# Altium project Mosfet_Driver_Circuit.PrjPcb
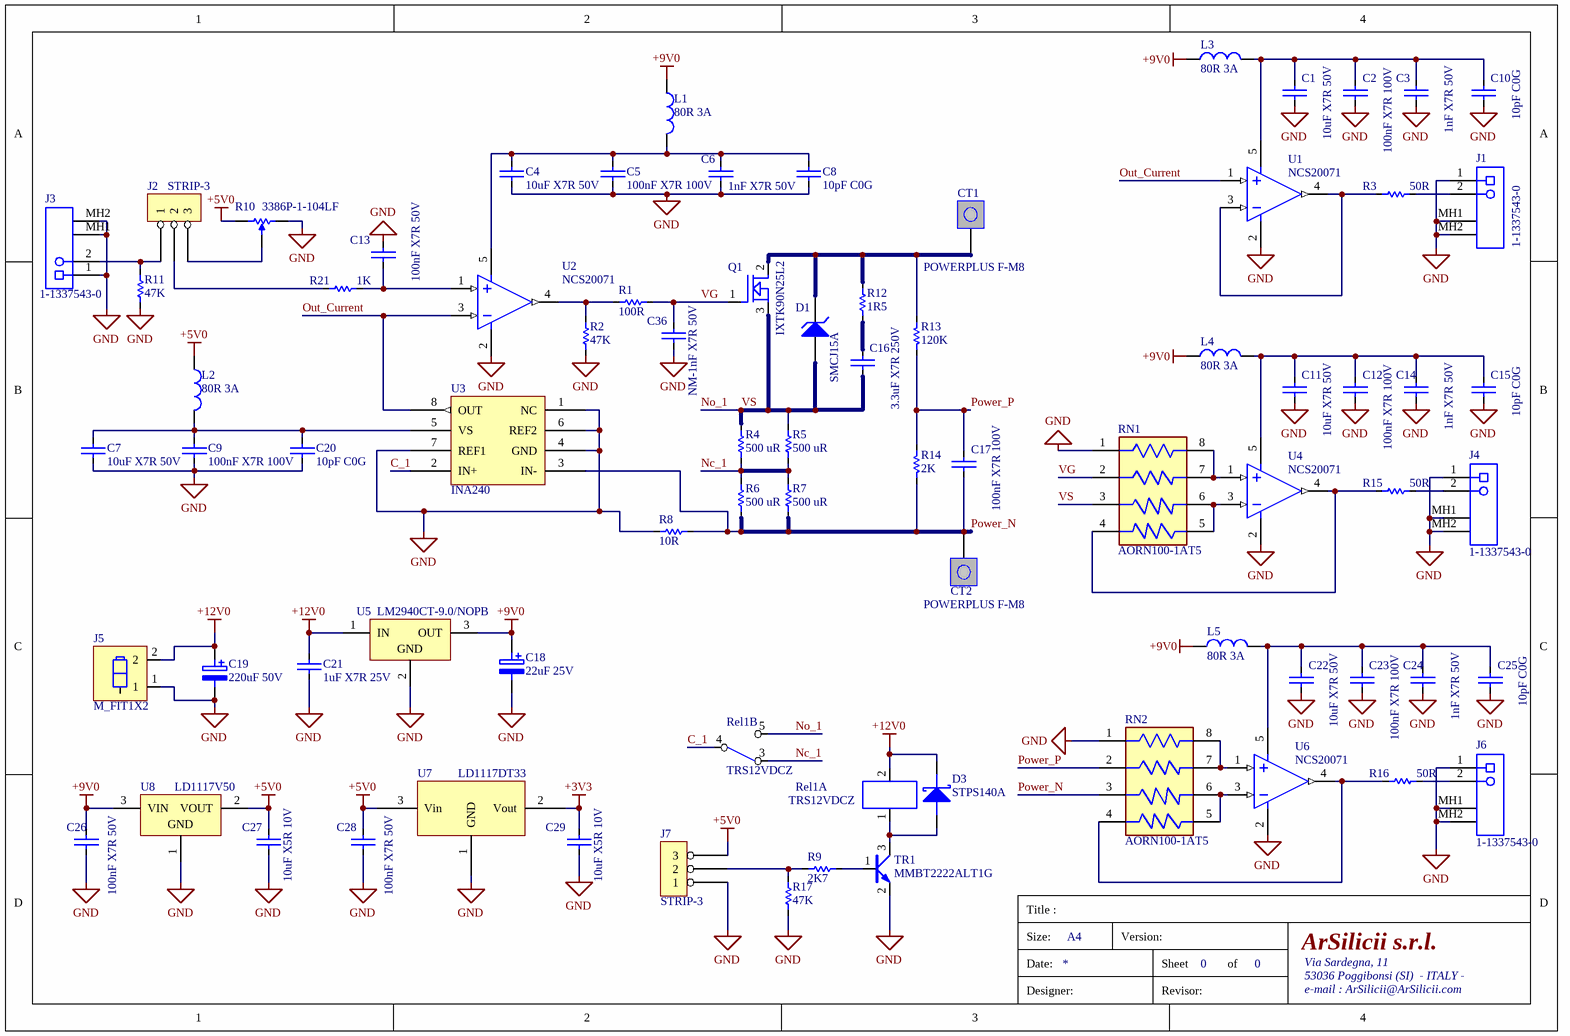
[diagram p0: Mosfet_Driver_Circuit.SchDoc]
1 sheet, 77 parts. Net scope: global (net labels, ports and power ports of the same name join across sheets).
Board file: Mosfet_Driver_Circuit.PcbDoc

## Sheet Mosfet_Driver_Circuit.SchDoc
size A4; Organization: ArSilicii s.r.l.; Address1: Via Sardegna, 11; Address2: 53036 Poggibonsi (SI)  - ITALY -; Address3: e-mail : ArSilicii@ArSilicii.com; SheetNumber: 0; SheetTotal: 0

### Parts
C1  10uF X7R 50V  [1206]
C2  100nF X7R 100V  [0805]
C3  1nF X7R 50V  [0805]
C4  10uF X7R 50V  [1206]
C5  100nF X7R 100V  [0805]
C6  1nF X7R 50V  [0805]
C7  10uF X7R 50V  [1206]
C8  10pF C0G  [0805]
C9  100nF X7R 100V  [0805]
C10  10pF C0G  [0805]
C11  10uF X7R 50V  [1206]
C12  100nF X7R 100V  [0805]
C13  100nF X7R 50V  [0805]
C14  1nF X7R 50V  [0805]
C15  10pF C0G  [0805]
C16  3.3uF X7R 250V  [2220]
C17  100nF X7R 100V  [0805]
C18  22uF 25V  [TANT_D]
C19  220uF 50V  [C_G55]
C20  10pF C0G  [0805]
C21  1uF X7R 25V  [0805]
C22  10uF X7R 50V  [1206]
C23  100nF X7R 100V  [0805]
C24  1nF X7R 50V  [0805]
C25  10pF C0G  [0805]
C26  100nF X7R 50V  [0805]
C27  10uF X5R 10V  [0805]
C28  100nF X7R 50V  [0805]
C29  10uF X5R 10V  [0805]
C36  NM-1nF X7R 50V  [0805]
CT1  POWERPLUS F-M8  [PowerPlus M8]
CT2  POWERPLUS F-M8  [PowerPlus M8]
D1  SMCJ15A  [LFUS-DO-214AB-2_V]
D3  STPS140A  [SMA]
J1  1-1337543-0  [TECO-1-1337543-0_V]
J2  STRIP-3  [SIP-3]
J3  1-1337543-0  [TECO-1-1337543-0_V]
J4  1-1337543-0  [TECO-1-1337543-0_V]
J5  M_FIT1X2  [M_FIT_JR1X2V]
J6  1-1337543-0  [TECO-1-1337543-0_V]
J7  STRIP-3  [SIP-3]
L1  80R 3A  [1206]
L2  80R 3A  [1206]
L3  80R 3A  [1206]
L4  80R 3A  [1206]
L5  80R 3A  [1206]
Q1  IXTK90N25L2  [TO-247]
R1  100R  [0805]
R2  47K  [0805]
R3  50R  [0805]
R4  500 uR  [2512]
R5  500 uR  [2512]
R6  500 uR  [2512]
R7  500 uR  [2512]
R8  10R  [1206]
R9  2K7  [0805]
R10  3386P-1-104LF  [BOUR-3386P]
R11  47K  [0805]
R12  1R5  [2512]
R13  120K  [2512]
R14  2K  [2512]
R15  50R  [0805]
R16  50R  [0805]
R17  47K  [0805]
R21  1K  [0805]
Rel1  TRS12VDCZ  [RELE_TRS]  (parts A,B of 2)
RN1  AORN100-1AT5  [FP-AORN100-1AT5-IPC_C]
RN2  AORN100-1AT5  [FP-AORN100-1AT5-IPC_C]
TR1  MMBT2222ALT1G  [SOT-23]
U1  NCS20071  [SOT-553-5]
U2  NCS20071  [SOT-553-5]
U3  INA240  [TSSOP-8]
U4  NCS20071  [SOT-553-5]
U5  LM2940CT-9.0/NOPB  [NDE0003A]
U6  NCS20071  [SOT-553-5]
U7  LD1117DT33  [TO-252-7805]
U8  LD1117V50  [TO220]

### Nets
+3V3: C29.1 U7.2(Vout)
+5V0: C27.1 C28.1 J7.3 L2.1 R10.1 U7.3(Vin) U8.2(VOUT)
+9V0: C18.1 C26.1 L1.1 L3.1 L4.1 L5.1 U5.3(OUT) U8.3(VIN)
+12V0: C19.1 C21.1 D3.K J5.2 Rel1.2 U5.1(IN)
GND: C1.2 C2.2 C3.2 C4.2 C5.2 C6.2 C7.2 C8.2 C9.2 C10.2 C11.2 C12.2 C13.1 C14.2 C15.2 C18.2 C19.2 C20.2 C21.2 C22.2 C23.2 C24.2 C25.2 C26.2 C27.2 C28.2 C29.2 C36.2 J1.1 J1.MH1 J1.MH2 J3.1 J3.MH1 J3.MH2 J4.1 J4.MH1 J4.MH2 J5.1 J6.1 J6.MH1 J6.MH2 J7.1 R2.2 R8.2 R10.3 R11.1 R17.2 RN1.1 RN2.1 TR1.2(E) U1.2 U2.2 U3.1(NC) U3.4(GND) U3.6(REF2) U3.7(REF1) U4.2 U5.2(GND) U6.2 U7.1(GND) U8.1(GND)
C_1: Rel1.4 U3.2(IN+)
Nc_1: R4.2 R5.2 R6.1 R7.1 Rel1.3
No_1: C16.2 D1.1(A) Q1.3(SOURCE) R4.1 R5.1 Rel1.5 RN1.3  [also labelled VS]
Out_Current: U1.1 U2.3 U3.8(OUT)
Power_N: C17.2 CT2.1 R6.2 R7.2 R8.1 R14.2 RN2.3 U3.3(IN-)
Power_P: C17.1 R13.2 R14.1 RN2.2
VG: C36.1 Q1.1(GATE) R1.2 RN1.2
NetC1_1: C1.1 C2.1 C3.1 C10.1 L3.2 U1.5
NetC4_1: C4.1 C5.1 C6.1 C8.1 L1.2 U2.5
NetC7_1: C7.1 C9.1 C20.1 L2.2 U3.5(VS)
NetC11_1: C11.1 C12.1 C14.1 C15.1 L4.2 U4.5
NetC13_2: C13.2 R21.2 U2.1
NetC16_1: C16.1 R12.2
NetC22_1: C22.1 C23.1 C24.1 C25.1 L5.2 U6.5
NetCT1_1: CT1.1 D1.2(K) Q1.2(DRAIN) R12.1 R13.1
NetD3_A: D3.A Rel1.1 TR1.3(C)
NetJ1_2: J1.2 R3.1
NetJ2_1: J2.1 J3.2 R11.2
NetJ2_2: J2.2 R21.1
NetJ2_3: J2.3 R10.2
NetJ4_2: J4.2 R15.1
NetJ6_2: J6.2 R16.1
NetJ7_2: J7.2 R9.2 R17.1
NetR1_1: R1.1 R2.1 U2.4
NetR3_2: R3.2 U1.3 U1.4
NetR9_1: R9.1 TR1.1(B)
NetR15_2: R15.2 RN1.4 U4.4
NetR16_2: R16.2 RN2.4 U6.4
NetRN1_5: RN1.5 RN1.6 U4.3
NetRN1_7: RN1.7 RN1.8 U4.1
NetRN2_5: RN2.5 RN2.6 U6.3
NetRN2_7: RN2.7 RN2.8 U6.1

### Notes on the sheet
- Title :
- Size:
- Date:
- A4
- Version:
- Sheet
- of
- Designer:
- Revisor:

### Library data of the parts
C1 C4 C7 C11 C22 = CAP_10uF X7R 50V_1206: Capacità; ArSilicii Part Number: CPC0232011; Manufacturer Part Number: CL31B106KBHNNNE; SMD/TH: SMD; 1 Supplier: ARROW ELECTRONICS ITALIA S.R.L.; 1 Supplier Part Number: CL31B106KBHNNNE; 1 Supplier Unit Price: *; 2 Supplier: *; 2 Supplier Part Number: *; 2 Supplier Unit Price: *; 3 Supplier: *; 3 Supplier Part Number: *; 3 Supplier Unit Price: *; Manufacturer: *; ComponentLink1URL: *; ComponentLink2URL: *; ComponentLink1Description: Datasheet for 10uF X7R 25V; ComponentLink2Description: *; HelpURL: *
C2 C5 C9 C12 C17 C23 = CAP_100nF X7R 100V_0805: Capacità; ArSilicii Part Number: CPC0213101; Manufacturer: SAMSUNG; Manufacturer Part Number: CL21B104KCFSFNG; SMD/TH: SMD; 1 Supplier: ARROW ELECTRONICS ITALIA S.R.L.; 1 Supplier Part Number: CL21B104KCFSFNG; 1 Supplier Unit Price: *; 2 Supplier: FARNELL ITALIA S.R.L.; 2 Supplier Part Number: 1907331; 2 Supplier Unit Price: *; 3 Supplier: *; 3 Supplier Part Number: *; 3 Supplier Unit Price: *; ComponentLink1URL: *; ComponentLink2URL: *; ComponentLink1Description: *; ComponentLink2Description: *; HelpURL: *
C3 C6 C14 C24 C36 = CAP_1nF X7R 50V_0805: Capacità; ArSilicii Part Number: CPC0213001; Manufacturer: EPCOS / TDK; Manufacturer Part Number: B37941K5102K60; SMD/TH: SMD; 1 Supplier: DISTAR S.R.L.; 1 Supplier Part Number: B37941K5102K60; 1 Supplier Unit Price: 0,00235; 2 Supplier: ARROW ELECTRONICS ITALIA S.R.L.; 2 Supplier Part Number: 0805B102K5CT; 2 Supplier Unit Price: *; 3 Supplier: *; 3 Supplier Part Number: *; 3 Supplier Unit Price: *; ComponentLink1URL: *; ComponentLink2URL: *; ComponentLink1Description: *; ComponentLink2Description: *; HelpURL: *
C8 C10 C15 C20 C25 = CAP_10pF C0G_0805: Capacità; ArSilicii Part Number: CPC0614010; SMD/TH: SMD; 1 Supplier: *; 1 Supplier Part Number: *; 1 Supplier Unit Price: 0,09; 2 Supplier: *; 2 Supplier Part Number: *; 2 Supplier Unit Price: *; 3 Supplier: *; 3 Supplier Part Number: *; 3 Supplier Unit Price: *; Manufacturer: *; Manufacturer Part Number: *; ComponentLink1URL: *; ComponentLink2URL: *; ComponentLink1Description: *; ComponentLink2Description: *; HelpURL: *
C13 C26 C28 = CAP_100nF X7R 50V_0805: Capacità; ArSilicii Part Number: CPC0213100; Manufacturer: Kemet; Manufacturer Part Number: C0805C104K5RAC7800; SMD/TH: SMD; 1 Supplier: ARROW ELECTRONICS ITALIA S.R.L.; 1 Supplier Part Number: C0805C104K5RAC7800; 1 Supplier Unit Price: 0,00240; 2 Supplier: AVNET EMG ITALY S.R.L.; 2 Supplier Part Number: 08055C104KAT2A AVX; 2 Supplier Unit Price: *; 3 Supplier: *; 3 Supplier Part Number: *; 3 Supplier Unit Price: *; ComponentLink1URL: *; ComponentLink2URL: *; ComponentLink1Description: *; ComponentLink2Description: *; HelpURL: *
C16 = CAP_1uF X7R 250V_2220: Capacità; Manufacturer: TDK; Manufacturer Part Number: CGA9N3X7R2E105K230KA; SMD/TH: SMD; 1 Supplier: FARNELL ITALIA S.R.L.; 1 Supplier Part Number: 2435506; 1 Supplier Unit Price: 0,606; 2 Supplier: MOUSER; 2 Supplier Part Number: 810-CGA9N3X7R2E105K; 2 Supplier Unit Price: 0,594; 3 Supplier: *; 3 Supplier Part Number: *; 3 Supplier Unit Price: *; ArSilicii Part Number: *; ComponentLink1URL: *; ComponentLink2URL: *; ComponentLink1Description: *; ComponentLink2Description: *; HelpURL: *
C18 = CAP_TANT_22uF 25V Case D: Capacità polarizzata; ArSilicii Part Number: CPC0352022; Manufacturer: Kemet; Manufacturer Part Number: T491D226K025AT; SMD/TH: SMD; 1 Supplier: DISTAR S.R.L.; 1 Supplier Part Number: KETT491D226K025AT; 1 Supplier Unit Price: 0,060; 2 Supplier: ABACUS ECC S.R.L. - UNIPERSONALE; 2 Supplier Part Number: KETT491D226K025AT; 2 Supplier Unit Price: *; 3 Supplier: ARROW ELECTRONICS ITALIA S.R.L.; 3 Supplier Part Number: KETT491D226K025AT; 3 Supplier Unit Price: *; ComponentLink1URL: *; ComponentLink2URL: *; ComponentLink1Description: *; ComponentLink2Description: *; HelpURL: *
C19 = CAP_EL_220uF 50V: Capacità polarizzata; ArSilicii Part Number: CPC0402221; Manufacturer: Nichicon; Manufacturer Part Number: UPS1H221MPD; SMD/TH: TH; 1 Supplier: ARROW ELECTRONICS ITALIA S.R.L.; 1 Supplier Part Number: *; 1 Supplier Unit Price: 0,04516; 2 Supplier: RS COMPONENTS S.P.A.; 2 Supplier Part Number: 5194346; 2 Supplier Unit Price: *; 3 Supplier: *; 3 Supplier Part Number: *; 3 Supplier Unit Price: *; ComponentLink1URL: http://docs-europe.electrocomponents.com/webdocs/0649/0900766b8064973a.pdf; ComponentLink2URL: *; ComponentLink1Description: Datasheet for 220uF 50V; ComponentLink2Description: *; HelpURL: *
C21 = CAP_1uF X7R 25V_0805: Capacità; ArSilicii Part Number: CPC0212002; Manufacturer: Samsung; Manufacturer Part Number: CL21B105KAFNNNG; SMD/TH: SMD; 1 Supplier: AVNET EMG ITALY S.R.L.; 1 Supplier Part Number: CL21B105KAFNNNG; 1 Supplier Unit Price: *; 2 Supplier: *; 2 Supplier Part Number: *; 2 Supplier Unit Price: *; 3 Supplier: *; 3 Supplier Part Number: *; 3 Supplier Unit Price: *; ComponentLink1URL: *; ComponentLink2URL: *; ComponentLink1Description: *; ComponentLink2Description: *; HelpURL: *
C27 C29 = CAP_10uF X5R 10V_0805: Capacità; ArSilicii Part Number: CPC0212010; Manufacturer: Samsung; Manufacturer Part Number: CL21A106KPFNNNE; SMD/TH: SMD; 1 Supplier: ARROW ELECTRONICS ITALIA S.R.L.; 1 Supplier Part Number: CL21A106KPFNNNE; 1 Supplier Unit Price: *; 2 Supplier: *; 2 Supplier Part Number: *; 2 Supplier Unit Price: *; 3 Supplier: *; 3 Supplier Part Number: *; 3 Supplier Unit Price: *; ComponentLink1URL: *; ComponentLink2URL: *; ComponentLink1Description: *; ComponentLink2Description: *; HelpURL: \\Sorp\articoli\CPC0212010\F3102_CerPerChar.pdf
CT1 CT2 = PAD_POWERPLUS F-M8: Singolo contatto; ArSilicii Part Number: QC04000180; Manufacturer: WURTH; Manufacturer Part Number: 93517; SMD/TH: TH; 1 Supplier: Würth Elektronik ICS GmbH & Co. KG; 1 Supplier Part Number: S98978; 1 Supplier Unit Price: *; 2 Supplier: *; 2 Supplier Part Number: *; 2 Supplier Unit Price: *; 3 Supplier: *; 3 Supplier Part Number: *; 3 Supplier Unit Price: *; ComponentLink1URL: *; ComponentLink2URL: *; ComponentLink1Description: *; ComponentLink2Description: *; HelpURL: *
D1 = CMP-2000-07102-1: Transient Voltage Suppression Diode, 15 V, -65 to 150 degC, 2-Pin DO-214AB (SMCJ), RoHS, Tape and Reel; Manufacturer: Littelfuse; Directional: Uni-Directional; Power Dissipation: 1500W; Clamping Voltage-Max: 24.4V; Breakdown Voltage-Min: 16.7V; Breakdown Voltage-Max: 18.5V; Mounting Technology: SurfaceMount; Package Reference: DO-214AB; Manufacturer URL: http://www.littelfuse.com/; Package Description: 2-Pin Surface Mount Device, Body 6.855 x 5.905 mm; Datasheet URL: http://www.littelfuse.com/products/tvs-diodes/surface-mount/~/media/electronics/datasheets/tvs_diodes/littelfuse_tvs_diode_smcj_datasheet.pdf.pdf; Datasheet Version: 11/2015
D3 = DIODE SCHOTTKY_STPS140A: Diodo Schottky; Manufacturer: STMicroelectronics; ArSilicii Part Number: CPDS117000; SMD/TH: SMD; Manufacturer Part Number: STPS140A; 1 Supplier Part Number: STMSTPS140A; 2 Supplier: *; 2 Supplier Part Number: *; 2 Supplier Unit Price: *; 3 Supplier Part Number: *; 1 Supplier: ARROW ELECTRONICS ITALIA S.R.L.; 1 Supplier Unit Price: 0,0600; 3 Supplier: *; 3 Supplier Unit Price: *; ComponentLink1URL: http://www.st.com/web/en/resource/technical/document/datasheet/CD00001107.pdf; ComponentLink2URL: *; ComponentLink1Description: Datasheet for STPS140A; ComponentLink2Description: *; HelpURL: *
J1 J3 J4 J6 = CMP-2000-05853-1: Female Connector, Pitch 2.54 mm, 1 x 2 Position, Height 15.8 mm, Tail Length 3.8 mm, / -55 to 85 degC, RoHS, Bulk; Manufacturer: TE Connectivity; Connector Body Style: RightAngleJack; Frequency Max: 4GHz; Coaxial Termination: Solder; Connector Mounting: PCBMount; SVHC: ToBeAdvised; Connector Type: BNCCoaxial; Impedance: 50ohm; Coaxial Cable Types: -; Manufacturer URL: http://www.te.com/; Package Reference: 1-1337543-0; Product Range: -; Datasheet URL: http://www.te.com/commerce/DocumentDelivery/DDEController?Action=showdoc&DocId=Customer+Drawing%7F1337543%7FG%7Fpdf%7FEnglish%7FENG_CD_1337543_G.pdf%7F1-1337543-0; Contact Plating: GoldPlatedContacts; Mounting Technology: ThroughHole; Package Description: Female Connector, Pitch 2.54 mm, 1 x 2 Position, Height 15.8 mm, Tail Length 3.8 mm; Contact Material: Brass; Datasheet Version: Rev. G, 12/2012
J2 J7 = HEADER 3: SMD/TH: TH; 1 Supplier: *; 1 Supplier Part Number: *; 1 Supplier Unit Price: *; 2 Supplier: *; 2 Supplier Part Number: *; 2 Supplier Unit Price: *; 3 Supplier: *; 3 Supplier Part Number: *; 3 Supplier Unit Price: *; ArSilicii Part Number: *; Manufacturer: *; Manufacturer Part Number: *; ComponentLink1URL: *; ComponentLink2URL: *; ComponentLink1Description: *; ComponentLink2Description: *; HelpURL: *
J5 = M_FIT1X2: Mini Fit Junior 2 poli; ArSilicii Part Number: QA02006000; Manufacturer: Molex; SMD/TH: TH; 1 Supplier: ABACUS ECC S.R.L. - UNIPERSONALE; 1 Supplier Part Number: *; 1 Supplier Unit Price: 0,07900; 2 Supplier: HT COMPONENTI ELETTRONICI S.R.L.; 2 Supplier Part Number: *; 2 Supplier Unit Price: *; 3 Supplier: *; 3 Supplier Part Number: *; 3 Supplier Unit Price: *; Manufacturer Part Number: 39-28-1023; ComponentLink1URL: http://www.molex.com/webdocs/datasheets/pdf/en-us/0039281023_PCB_HEADERS.pdf; ComponentLink2URL: *; ComponentLink1Description: Datasheet for M_FIT1X2; ComponentLink2Description: *; HelpURL: *
L1-L5 = Ferrite 80R 3A: Ferrite; ArSilicii Part Number: CPF0006000; Manufacturer: Wurth Elektronik; Manufacturer Part Number: 74279215; SMD/TH: SMD; 1 Supplier: RS COMPONENTS S.P.A.; 1 Supplier Part Number: 3275550P; 1 Supplier Unit Price: 0,21000; 2 Supplier: *; 2 Supplier Part Number: *; 2 Supplier Unit Price: *; 3 Supplier: *; 3 Supplier Part Number: *; 3 Supplier Unit Price: *; ComponentLink1URL: http://docs-europe.electrocomponents.com/webdocs/0033/0900766b80033a26.pdf; ComponentLink2URL: *; ComponentLink1Description: Datasheet for Ferrite 80R 3A; ComponentLink2Description: *; HelpURL: *; Supplier 1: Digi-Key; Supplier Part Number 1: 732-1629-1-ND
Q1 = IXTK90N25L2: MOS CANALE N-250V-90A Linear; ArSilicii Part Number: CPTP200080; Manufacturer Part Number: IPB90N06S404ATMA2; SMD/TH: SMD; 1 Supplier: EBV ELEKTRONIK S.R.L.; 1 Supplier Part Number: PB90N06S4-04; 1 Supplier Unit Price: 0,56; 2 Supplier: RS COMPONENTS S.R.L.; 2 Supplier Part Number: 826-9042P; 2 Supplier Unit Price: *; 3 Supplier: *; 3 Supplier Part Number: *; 3 Supplier Unit Price: *; Manufacturer: *; ComponentLink1URL: *; ComponentLink2URL: *; ComponentLink1Description: *; ComponentLink2Description: *; HelpURL: *
R1-R9 R11-R17 R21 = RES_SMD: Resistenza; SMD/TH: SMD; 1 Supplier: *; 1 Supplier Part Number: *; 1 Supplier Unit Price: *; 2 Supplier: *; 2 Supplier Part Number: *; 2 Supplier Unit Price: *; 3 Supplier: *; 3 Supplier Part Number: *; 3 Supplier Unit Price: *; ArSilicii Part Number: *; Manufacturer: *; Manufacturer Part Number: *; ComponentLink1URL: *; ComponentLink2URL: *; ComponentLink1Description: *; ComponentLink2Description: *; HelpURL: *
R10 = CMP-2000-05592-1: Square Trimpot(R) Trimming Potentiometer, 100 KOhm, +/- 10%, 0.5 W, -55 to 125 degC, 3-Pin THD, RoHS, Tube; Manufacturer Series: 3386; Manufacturer: Bourns; Resistive Element Material: Cermet; Shaft Diameter: 3.15mm; Number of Turns: 1; Product Height: 4.83mm; Temperature Coefficient: 100ppm/C; Product Depth: 9.53mm; Rated Temperature (Cel): 85; Actuator Orientation: Vertical; Resistance (ohm): 100000; Power Rating: 1/2W; Tolerance (%): 10; Rated Power Dissipation (P) (W): 0.5; Resistance Law: Linear; Actuator Type: Screw; Operating Temperature-Min (Cel): -55; Manufacturer URL: http://www.bourns.com/; Terminal Finish: TINLEAD; Datasheet Version: 05/2016; Tolerance: 10%; Lead Free: NO; Family: 3386; Product Length: 9.53mm; Mounting: ThroughHole; Packaging: Tube; Package: RectangularPackage; Mounting Feature: ThroughHole; Number of Terminals: 3; Minimum Operating Temperature: -55C; Mounting Technology: ThroughHole; Package Reference: 3386P; Maximum Operating Temperature: 125C; Termination Style: Pin; Datasheet URL: http://www.bourns.com/docs/Product-Datasheets/3386.pdf; Package Description: 3-Pin Through Hole Device, Body 9.53 x 9.53 mm, Pitch 2.54 mm; Product Type: Potentiometer; Operating Temperature-Max (Cel): 125; Resistance Value: 100KOhm; Terminal Shape: WIRE; Technology: Cermet; Type: Trimmer
Rel1 = RELE'_TRS12VDCZ: Relay; ArSilicii Part Number: CR00015100; Manufacturer: Tianbo; SMD/TH: TH; 1 Supplier: DISTAR S.R.L.; 1 Supplier Part Number: TRS12VDCZ; 1 Supplier Unit Price: 0,337; 2 Supplier: STEALTH COMPONENTS, INC.; 2 Supplier Part Number: FRS3M C-S DC12V; 2 Supplier Unit Price: *; 3 Supplier: FITRE S.P.A.; 3 Supplier Part Number: R504D/012Z1F; 3 Supplier Unit Price: *; Manufacturer Part Number: TRS12VDCZ; ComponentLink1URL: http://www.spbnek.ru/mycontent/firm/tianbo/trs.pdf; ComponentLink2URL: *; ComponentLink1Description: Datasheet for TRS12VDCZ; ComponentLink2Description: *; HelpURL: *
RN1 RN2 = CMP-02406-000003-1: RES NETWORK 4 RES MULT OHM 8SOIC; Manufacturer: Vishay; Resistance: 1/100kΩ; Standoff Height: 0.1524mm; Temperature Coefficient: 25ppm/°C; Automotive Grade: Grade 0; Tolerance: 0.1%; Number Of Resistors: 4; Value: 1/100kΩ; Power Per Resistor: 100mW; Power Rating: 400mW; Lead Free: Yes; Package: AORN100-1AT5; Manufacturer Part Number: AORN100-1AT5; Category: Res; Temperature Range High: +155°C; Device Class L3: Resistor Arrays; Automotive: Yes; Temperature: -55°C to +155°C; Termination: Gull-Wing; Ipc Land Pattern Name: SOIC127P607X173-8; Device Class L1: Passive Components; Series: AORN; Octopart: https://octopart.com/aorn1001at5-vishay-54384707; ComponentLink2Description: Datasheet; Digikey Description: RES NETWORK 4 RES MULT OHM 8SOIC; Composition: Thin Film; Device Class L2: Resistors; ComponentLink2URL: https://www.vishay.com/docs/60127/aorn.pdf; RoHS: TRUE; Temperature Range Low: -55°C; Height: 1.73mm
TR1 = NPN_MMBT2222ALT1G: NPN Transistor; ArSilicii Part Number: CPTS001000; Manufacturer: ON SEMICONDUCTOR; SMD/TH: SMD; Supplier 1: Farnell; Supplier Part Number 1: 1459098; 1 Supplier: ARROW ELECTRONICS ITALIA S.R.L.; 1 Supplier Part Number: SCGMMBT2222ALT1G; 1 Supplier Unit Price: 0,00777; 2 Supplier: Farnell; 2 Supplier Part Number: 1459098; 2 Supplier Unit Price: 0,085; 3 Supplier: *; 3 Supplier Part Number: *; 3 Supplier Unit Price: *; Manufacturer Part Number: MMBT2222ALT1G; ComponentLink1URL: http://www.onsemi.com/pub_link/Collateral/MMBT2222LT1-D.PDF; ComponentLink2URL: *; ComponentLink1Description: Datasheet for MMBT2222ALT1G; ComponentLink2Description: *; HelpURL: D:\Documenti ArSilicii\DataSheet\Transistor\MMBT2222LT1-D.pdf
U1 U2 U4 U6 = NCS20071: Rail-to-Rail Input/Output, 3 MHz Op Amps; Manufacturer: Microchip Technology; Manufacturer Part Number: MCP6021-E/SN; SMD/TH: SMD; 1 Supplier: DigiKey; 1 Supplier Part Number: MCP6021-E/SN-ND; 1 Supplier Unit Price: 1,22; 2 Supplier: *; 2 Supplier Part Number: *; 2 Supplier Unit Price: *; 3 Supplier: *; 3 Supplier Part Number: *; 3 Supplier Unit Price: *; ArSilicii Part Number: *; ComponentLink1URL: http://ww1.microchip.com/downloads/en/DeviceDoc/21685d.pdf; ComponentLink2URL: *; ComponentLink1Description: Datasheet for MCP6021; ComponentLink2Description: *; HelpURL: *
U3 = INA240: Current sense amplifier; SMD/TH: SMD; 2 Supplier Unit Price: *; 3 Supplier: *; 3 Supplier Part Number: *; 3 Supplier Unit Price: *; ComponentLink2URL: *; ComponentLink2Description: *
U5 = CMP-0062-02531-3: 1A Low Dropout Regulator, 3-pin TO-220, Pb-Free; Manufacturer: Texas Instruments; CompType: LDO IC; PowerWise: N; PackageTopMarking: NSUZXYTTE#*LM2940CT*-9.0 P+; PackageDescription: TO-220, Molded, 3 Lead, Straight; PackageReference: NDE0003A; PinCount: 3; ComponentLink1URL: http://www.ti.com/general/docs/lit/getliterature.tsp?genericPartNumber=LM2940C&fileType=pdf; ComponentLink1Description: Datasheet URL; RoHS: Y
U7 = LD1117DT33: Regolatore Low Dropout; ArSilicii Part Number: IC01000010; Manufacturer: ST; SMD/TH: SMD; 1 Supplier: HT COMPONENTI ELETTRONICI S.R.L.; 1 Supplier Part Number: LD1117DT33TR TO252-3; 1 Supplier Unit Price: 0,105; 2 Supplier: EBV ELEKTRONIK S.R.L.; 2 Supplier Part Number: *; 2 Supplier Unit Price: *; 3 Supplier: *; 3 Supplier Part Number: *; 3 Supplier Unit Price: *; Manufacturer Part Number: LD1117DT33; ComponentLink1URL: http://www.st.com/st-web-ui/static/active/en/resource/technical/document/datasheet/CD00000544.pdf; ComponentLink2URL: *; ComponentLink1Description: Datasheet for LD1117DT33; ComponentLink2Description: *; HelpURL: D:\Documenti ArSilicii\DataSheet\Regolatori\LD1117.pdf
U8 = CMP-0244-00472-1: Fixed Low Drop Positive Voltage Regulator, 5V, 3-Pin TO-220; ComponentLink1URL: http://www.st.com; ComponentLink1Description: Manufacturer URL; DatasheetVersion: 1/11/2011; PackageDescription: TO, Thru-Hole, Vertical, Heatsink Mounted; 3 In-Line Leads; Pitch 2.54 mm; ComponentLink2Description: Datasheet; ComponentLink3URL: http://www.st.com/internet/com/TECHNICAL_RESOURCES/TECHNICAL_LITERATURE/PACKAGE_INFORMATION/CD00004649.pdf; PackageVersion: ver3.0; PackageReference: TO220; ComponentLink2URL: http://www.st.com/internet/com/TECHNICAL_RESOURCES/TECHNICAL_LITERATURE/DATASHEET/CD00000544.pdf; ComponentLink3Description: Package Specification